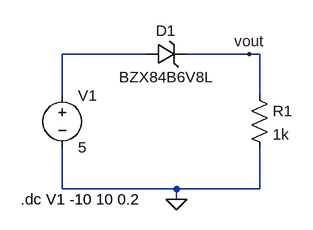
[diagram p0: schematic Zener Breakdown.asc]
Zener Breakdown.asc, the LTspice schematic file:
Version 4
SHEET 1 880 680
WIRE 400 48 272 48
WIRE 560 48 464 48
WIRE 576 48 560 48
WIRE 272 112 272 48
WIRE 576 112 576 48
WIRE 272 256 272 192
WIRE 448 256 272 256
WIRE 576 256 576 192
WIRE 576 256 448 256
WIRE 448 272 448 256
FLAG 448 272 0
FLAG 560 48 vout
SYMBOL voltage 272 96 R0
SYMATTR InstName V1
SYMATTR Value 5
SYMBOL zener 400 64 R270
WINDOW 0 36 32 VTop 2
WINDOW 3 -4 32 VBottom 2
SYMATTR InstName D1
SYMATTR Value BZX84B6V8L
SYMBOL res 560 96 R0
SYMATTR InstName R1
SYMATTR Value 1k
TEXT 208 272 Left 2 !.dc V1 -10 10 0.2

The netlist it stands for:
* Zener Breakdown.asc
V1 N001 0 5
D1 N001 vout BZX84B6V8L
R1 vout 0 1k
.model D D
.lib standard.dio
.dc V1 -10 10 0.2
.backanno
.end